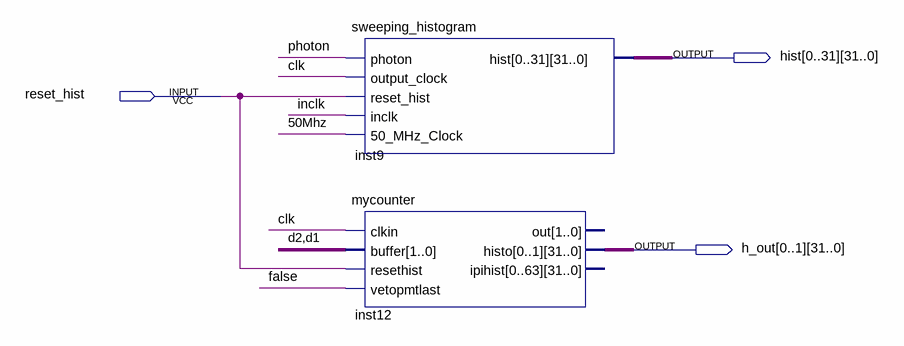
[diagram p0: schematic sheet]
// Quartus schematic sweeping hist removed from photons and plls.bdf as structural Verilog: 2 symbols, 3 pins
module \sweeping_hist_removed_from_photons_and_plls  (
  input  reset_hist,
  output [31:0] hist_0,
  output [31:0] hist_1,
  output [31:0] hist_2,
  output [31:0] hist_3,
  output [31:0] hist_4,
  output [31:0] hist_5,
  output [31:0] hist_6,
  output [31:0] hist_7,
  output [31:0] hist_8,
  output [31:0] hist_9,
  output [31:0] hist_10,
  output [31:0] hist_11,
  output [31:0] hist_12,
  output [31:0] hist_13,
  output [31:0] hist_14,
  output [31:0] hist_15,
  output [31:0] hist_16,
  output [31:0] hist_17,
  output [31:0] hist_18,
  output [31:0] hist_19,
  output [31:0] hist_20,
  output [31:0] hist_21,
  output [31:0] hist_22,
  output [31:0] hist_23,
  output [31:0] hist_24,
  output [31:0] hist_25,
  output [31:0] hist_26,
  output [31:0] hist_27,
  output [31:0] hist_28,
  output [31:0] hist_29,
  output [31:0] hist_30,
  output [31:0] hist_31,
  output [31:0] h_out_0,
  output [31:0] h_out_1
);

  wire \50Mhz , clk, d1, d2, false, inclk, photon;

  sweeping_histogram inst9 (
    .photon(photon), .output_clock(clk), .reset_hist(reset_hist), .inclk(inclk), .\50_MHz_Clock (\50Mhz ),
    .hist({hist_0, hist_1, hist_2, hist_3, hist_4, hist_5, hist_6, hist_7, hist_8, hist_9, hist_10, hist_11, hist_12, hist_13, hist_14, hist_15, hist_16, hist_17, hist_18, hist_19, hist_20, hist_21, hist_22, hist_23, hist_24, hist_25, hist_26, hist_27, hist_28, hist_29, hist_30, hist_31}));
  mycounter inst12 (
    .clkin(clk), .buffer({d2, d1}), .resethist(reset_hist), .vetopmtlast(false), .histo({h_out_0, h_out_1}));  // open: out, ipihist
endmodule
